# EAGLE design ir-sender (EAGLE 7.4.0)
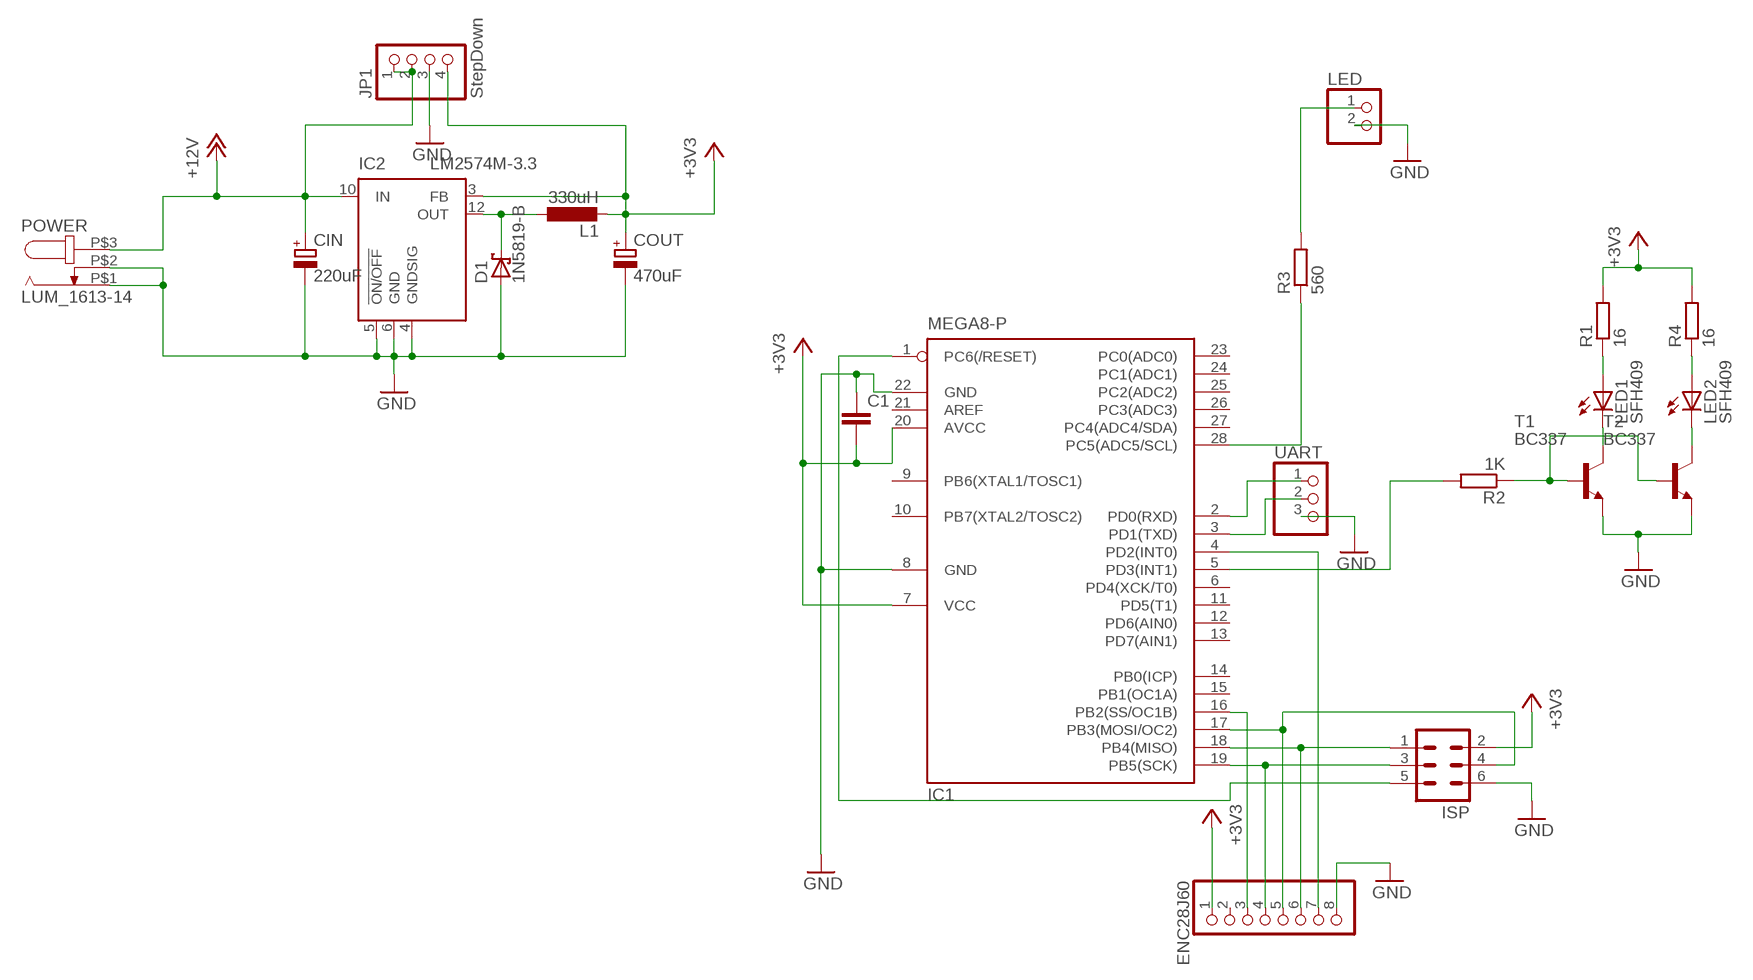
[diagram p0: schematic, sheet 1]

## Parts
C1  C-EU025-030X050  [C025-030X050]
CIN  220uF  CPOL-EUE3.5-8  [E3,5-8]
COUT  470uF  CPOL-EUE5-10.5  [E5-10,5]
D1  1N5819-B  [DO41-7.6]
ENC28J60  PINHD-1X8  [1X08]
IC1  MEGA8-P  [DIL28-3]
IC2  LM2574M-3.3  [SO14W]
ISP  ML6  [ML6]
JP1  StepDown  PINHD-1X4  [1X04]
L1  330uH  PIS4728  [PIS2816]
LED  PINHD-1X2  [1X02]
LED1  SFH409  LEDSFH482  [SFH482]
LED2  SFH409  LEDSFH482  [SFH482]
POWER  LUM_1613-14  [DCJ0202]
R1  16  R-EU_0207/7  [0207/7]
R2  1K  R-EU_0207/7  [0207/7]
R3  560  R-EU_0207/7  [0207/7]
R4  16  R-EU_0207/7  [0207/7]
T1  BC337  [TO92]
T2  BC337  [TO92]
UART  PINHD-1X3_2.54  [1X03]

## Nets
+3V3: C1.2 COUT.+ ENC28J60.1 IC1.7(VCC) IC1.20(AVCC) IC2.3(FB) ISP.2 JP1.4 L1.2 R1.2 R4.2
+12V: CIN.+ IC2.10(IN) JP1.1 JP1.2 POWER.P$3
GND: C1.1 CIN.- COUT.- D1.A ENC28J60.8 IC1.8(GND) IC1.22(GND) IC2.4(GNDSIG) IC2.5(!ON/OFF) IC2.6(GND) ISP.6 JP1.3 LED.2 POWER.P$1 POWER.P$2 T1.1(E) T2.1(E) UART.3
N$1: LED1.A R1.1
N$2: LED1.K(C) T1.3(C)
N$3: R2.1 T1.2(B) T2.2(B)
N$4: D1.C IC2.12(OUT) L1.1
N$5: LED.1 R3.2
N$6: ENC28J60.4 IC1.19(PB5(SCK)) ISP.3
N$7: ENC28J60.5 IC1.17(PB3(MOSI/OC2)) ISP.4
N$8: ENC28J60.6 IC1.18(PB4(MISO)) ISP.1
N$9: IC1.1(PC6(/RESET)) ISP.5
N$10: ENC28J60.3 IC1.16(PB2(SS/OC1B))
N$12: IC1.28(PC5(ADC5/SCL)) R3.1
N$13: IC1.5(PD3(INT1)) R2.2
N$14: ENC28J60.7 IC1.4(PD2(INT0))
N$16: LED2.A R4.1
N$17: LED2.K(C) T2.3(C)
N$19: IC1.2(PD0(RXD)) UART.1
N$20: IC1.3(PD1(TXD)) UART.2
Unconnected: ENC28J60.2 IC1.6(PD4(XCK/T0)) IC1.9(PB6(XTAL1/TOSC1)) IC1.10(PB7(XTAL2/TOSC2)) IC1.11(PD5(T1)) IC1.12(PD6(AIN0)) IC1.13(PD7(AIN1)) IC1.14(PB0(ICP)) IC1.15(PB1(OC1A)) IC1.21(AREF) IC1.23(PC0(ADC0)) IC1.24(PC1(ADC1)) IC1.25(PC2(ADC2)) IC1.26(PC3(ADC3)) IC1.27(PC4(ADC4/SDA))

## Library data of the parts
C1 = rcl:C-EU: CAPACITOR, European symbol
CIN COUT = rcl:CPOL-EU: POLARIZED CAPACITOR, European symbol
D1 = diode:1N581*: 1.0A SCHOTTKY BARRIER RECTIFIER Source: http://www.diodes.com/datasheets/ds23001.pdf
ENC28J60 = pinhead:PINHD-1X8: PIN HEADER
IC1 = atmel:MEGA8-P: MICROCONTROLLER 8 Kbytes FLASH, 1 kbytes SRAM, 512 bytes EEPROM, USART, 4-channel 10 bit ADC, 2-channel 8 bit ADC Pin compatible with Atmega48, ATMega88, ATMega168 Source: avr.lbr; OC_FARNELL: unknown; OC_NEWARK: unknown
IC2 = linear:LM2574?-*: SIMPLE SWITCHER 0.5A Step-Down Voltage Regulator Source: http://cache.national.com/ds/LM/LM2574.pdf
ISP = con-ml:ML6: HARTING; OC_FARNELL: unknown; OC_NEWARK: unknown
JP1 = pinhead:PINHD-1X4: PIN HEADER
L1 = jbolay:PIS4728
LED = pinhead:PINHD-1X2: PIN HEADER
LED1 LED2 = led:LED: LED OSRAM: - CHIPLED LG R971, LG N971, LY N971, LG Q971, LY Q971, LO R971, LY R971 LH N974, LH R974 LS Q976, LO Q976, LY Q976 LO Q996 - Hyper CHIPLED LW Q18S LB Q993, LB Q99A, LB R99A - SideLED LS A670, LO A670, LY A670, LG A670, LP A670 LB A673, LV A673, LT A673, LW A673 LH A674 LY A675 LS A676, LA A676, LO A676, LY A676, LW A676 LS A679, LY A679, LG A679 - Hyper Micro SIDELED® LS Y876, LA Y876, LO Y876, LY Y876 LT Y87S - SmartLED LW L88C, LW L88S LB L89C, LB L89S, LG L890 LS L89K, LO L89K, LY L89K LS L896, LA L896, LO L896, LY L896 - TOPLED LS T670, LO T670, LY T670, LG T670, LP T670 LSG T670, LSP T670, LSY T670, LOP T670, LYG T670 LG T671, LOG T671, LSG T671 LB T673, LV T673, LT T673, LW T673 LH T674 LS T676, LA T676, LO T676, LY T676, LB T676, LH T676, LSB T676, LW T676 LB T67C, LV T67C, LT T67C, LS T67K, LO T67K, LY T67K, LW E67C LS E67B, LA E67B, LO E67B, LY E67B, LB E67C, LV E67C, LT E67C LW T67C LS T679, LY T679, LG T679 LS T770, LO T770, LY T770, LG T770, LP T770 LB T773, LV T773, LT T773, LW T773 LH T774 LS E675, LA E675, LY E675, LS T675 LS T776, LA T776, LO T776, LY T776, LB T776 LHGB T686 LT T68C, LB T68C - Hyper Mini TOPLED® LB M676 - Mini TOPLED Santana® LG M470 LS M47K, LO M47K, LY M47K Source: http://www.osram.convergy.de LUXEON: - LUMILED® LXK2-PW12-R00, LXK2-PW12-S00, LXK2-PW14-U00, LXK2-PW14-V00 LXK2-PM12-R00, LXK2-PM12-S00, LXK2-PM14-U00 LXK2-PE12-Q00, LXK2-PE12-R00, LXK2-PE12-S00, LXK2-PE14-T00, LXK2-PE14-U00 LXK2-PB12-K00, LXK2-PB12-L00, LXK2-PB12-M00, LXK2-PB14-N00, LXK2-PB14-P00, LXK2-PB14-Q00 LXK2-PR12-L00, LXK2-PR12-M00, LXK2-PR14-Q00, LXK2-PR14-R00 LXK2-PD12-Q00, LXK2-PD12-R00, LXK2-PD12-S00 LXK2-PH12-R00, LXK2-PH12-S00 LXK2-PL12-P00, LXK2-PL12-Q00, LXK2-PL12-R00 Source: www.luxeon.com KINGBRIGHT: KA-3528ASYC Source: www.kingbright.com
POWER = jbolay:LUM_1613-14: Netzgeräte-Einbaukupplung, abgewinkelte Ausführung, mit Öffner, für Leiterplatten, Surface-Mount-Technik (SMT) Hohlstecker Reichelt Artikel-Nr.: LUM 1613-14
R1-R4 = rcl:R-EU_: RESISTOR, European symbol
T1 T2 = transistor:BC337: NPN TRANSISTOR
UART = pinhead-1:PINHD-1X3: PIN HEADER

## Net classes
0 default: width 0.4 mm, drill 0.8 mm, clearance 0.254 mm

## Board
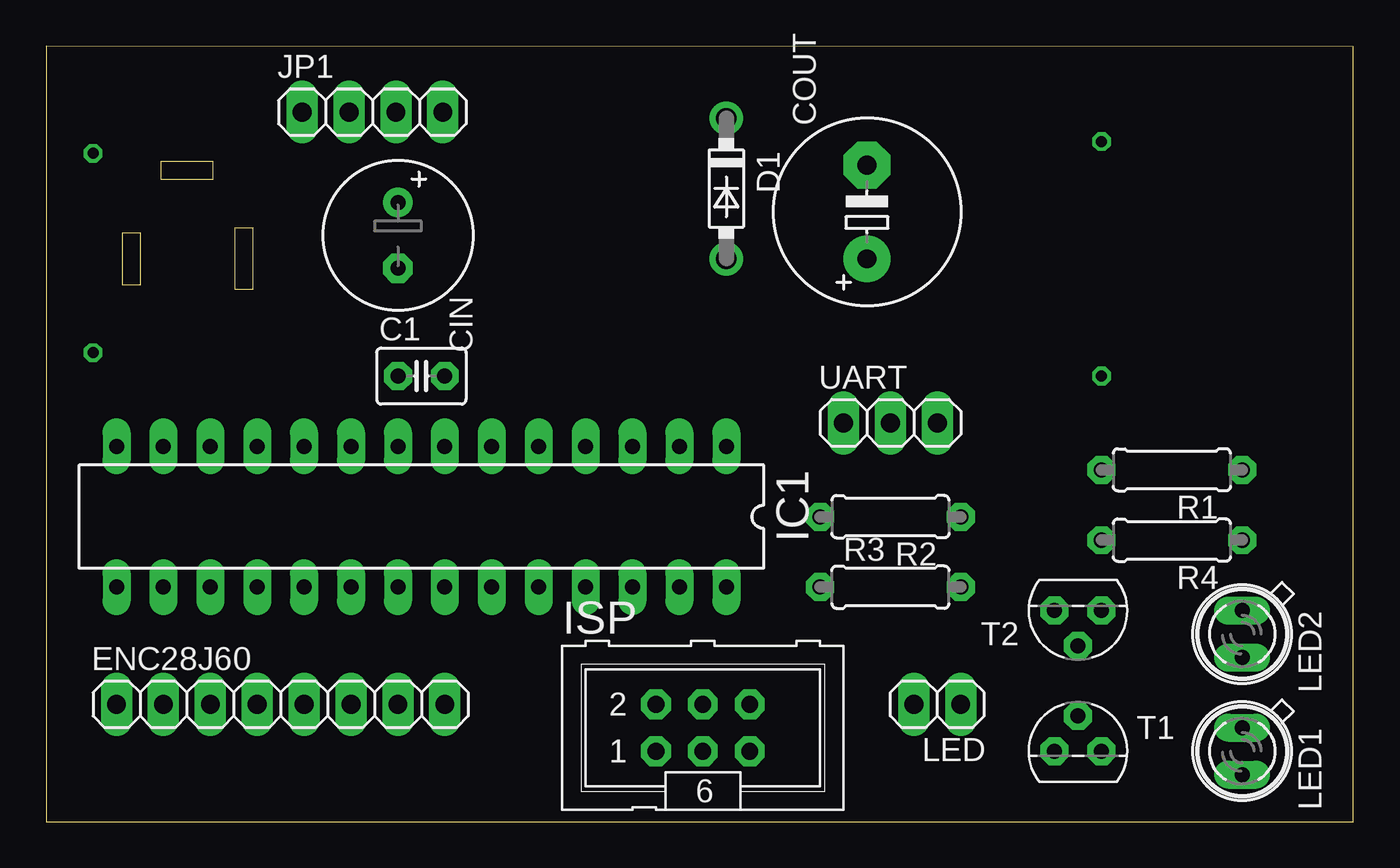
[diagram p1: board, top side]
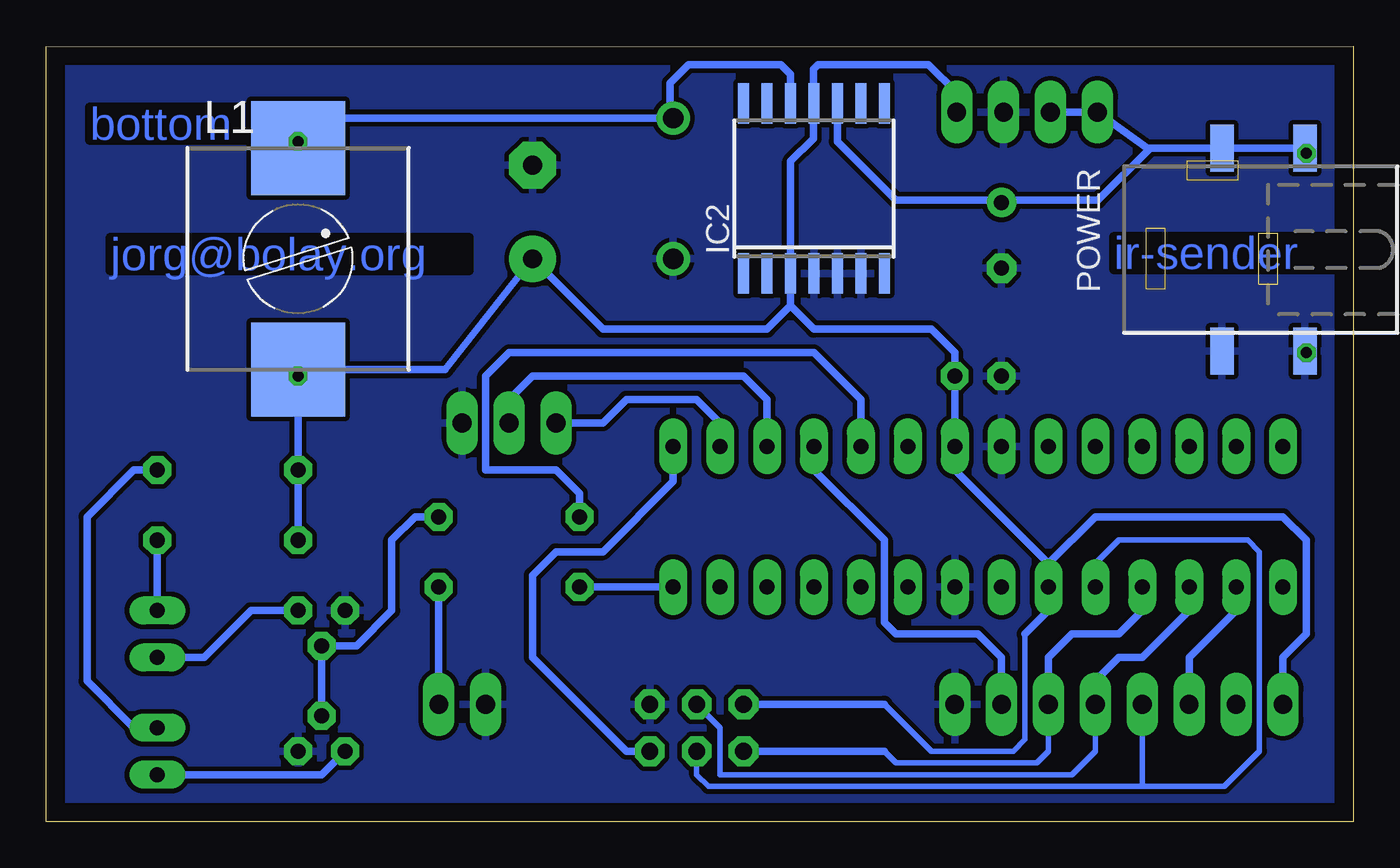
[diagram p2: board, bottom side, seen from below]

Size 70.79 x 42 mm. Coordinates in mm from the lower left corner, seen from the top.
Outline: 0,0 70.79,0 70.79,41.98 0,42 0,0
Copper layers (1*16): Top 0.035mm / dielectric 1.5mm / Bottom 0.035mm
Design rules "ir-sender *": minimum track width 10mil, minimum drill 0.8mm, track to track 0.205mm, track to pad 0.205mm, pad to pad 0.205mm, via to via 0.205mm, smd to smd 8mil, copper to edge 40mil, drill to drill 8mil, minimum pad ring 0.35mm, minimum via ring 8mil, stop-mask expansion 4mil, vias tented up to drill 0mil, thermal gap 10mil

### Footprints (pad centres in the part's own frame; a part is rotated, then mirrored left to right if it is on the bottom)
C025-030X050 = drill 0.813 octagon: 1 -1.27,0; 2 1.27,0
E3,5-8 = drill 0.813 pad 1.6: + -1.778,0 | drill 0.813 pad 1.6 octagon: - 1.778,0
E5-10,5 = drill 1.016 pad 2.54: + -2.54,0 | drill 1.016 pad 2.54 octagon: - 2.54,0
DO41-7.6 = drill 1.1 pad 1.7: A 3.81,0; C -3.81,0
1X08 = drill 1.016 long: 1 -8.89,0; 2 -6.35,0; 3 -3.81,0; 4 -1.27,0; 5 1.27,0; 6 3.81,0; 7 6.35,0; 8 8.89,0
DIL28-3 = drill 0.813 long: 1 -16.51,-3.81; 2 -13.97,-3.81; 3 -11.43,-3.81; 4 -8.89,-3.81; 5 -6.35,-3.81; 6 -3.81,-3.81; 7 -1.27,-3.81; 8 1.27,-3.81; 9 3.81,-3.81; 10 6.35,-3.81; 11 8.89,-3.81; 12 11.43,-3.81; 13 13.97,-3.81; 14 16.51,-3.81; 15 16.51,3.81; 16 13.97,3.81; 17 11.43,3.81; 18 8.89,3.81; 19 6.35,3.81; 20 3.81,3.81; 21 1.27,3.81; 22 -1.27,3.81; 23 -3.81,3.81; 24 -6.35,3.81; 25 -8.89,3.81; 26 -11.43,3.81; 27 -13.97,3.81; 28 -16.51,3.81
SO14W = smd 0.6 x 2.2: 1 -3.81,-4.6; 2 -2.54,-4.6; 3 -1.27,-4.6; 4 0,-4.6; 5 1.27,-4.6; 6 2.54,-4.6; 7 3.81,-4.6; 8 3.81,4.6; 9 2.54,4.6; 10 1.27,4.6; 11 0,4.6; 12 -1.27,4.6; 13 -2.54,4.6; 14 -3.81,4.6
ML6 = drill 0.914 octagon: 1 -2.54,-1.27; 2 -2.54,1.27; 3 0,-1.27; 4 0,1.27; 5 2.54,-1.27; 6 2.54,1.27
1X04 = drill 1.016 long: 1 -3.81,0; 2 -1.27,0; 3 1.27,0; 4 3.81,0
PIS2816 = smd 5.08 x 5.08: 1 0,6; 2 0,-6
1X02 = drill 1.016 long: 1 -1.27,0; 2 1.27,0
SFH482 = drill 0.813 long: A -1.27,0; K 1.27,0
DCJ0202 = smd 2.54 x 1.27: P$1 -5,-5; P$2 -5,-0.5; P$3 6,-5; P$4 6,-0.5
0207/7 = drill 0.813 octagon: 1 -3.81,0; 2 3.81,0
TO92 = drill 0.813 octagon: 1 1.27,0; 2 0,1.905; 3 -1.27,0
1X03 = drill 1.016 long: 1 -2.54,0; 2 0,0; 3 2.54,0

### Placement (x,y rotation side)
C1  20.32,24.13 0 top
CIN  19.05,31.75 270 top
COUT  44.45,33.02 90 top
D1  36.83,34.29 270 top
DRILEGEND  [DRILEGEND]  -8.03,-9.64 0 top  (outside the outline)
ENC28J60  12.7,6.35 0 top
IC1  20.32,16.51 180 top
IC2  29.21,34.29 0 bottom
ISP  35.56,5.08 0 top
JP1  17.67,38.43 0 top
L1  57.15,30.48 0 bottom
LED  48.26,6.35 180 top
LED1  64.77,3.81 270 top
LED2  64.77,10.16 270 top
POWER  7.62,30.48 90 bottom
R1  60.96,19.05 180 top
R2  45.72,16.51 180 top
R3  45.72,12.7 0 top
R4  60.96,15.24 180 top
T1  55.88,3.81 0 top
T2  55.88,11.43 180 top
UART  45.72,21.59 0 top

### Tracks (layer width: path | path; a pad name or v marks a point on that pad's centre or on a via)
+3V3  (via drill 0.6)
  Bottom 0.305: 17.78,10.16 17.78,4.45 18.41,3.81 22.86,3.81 25.4,6.35
  Bottom 0.406: R4.2 R1.2 v57.15,24.13 L1.2 49.18,24.48 COUT.+ 40.64,26.67 31.75,26.67 30.48,27.94 | ISP.2 25.4,6.35 | 17.78,10.16 16.51,11.43 IC1.20 16.51,13.97 | 16.51,13.97 21.59,19.05 IC1.7 C1.2 21.59,25.4 22.86,26.67 29.21,26.67 30.48,27.94 | ENC28J60.1 3.81,8.89 2.54,10.16 2.54,15.24 3.81,16.51 13.97,16.51 16.51,13.97 | 30.48,27.94 IC2.3 30.48,35.77 29.25,37 29.25,40.75 29,41 23,41 21.48,39.48 JP1.4
+12V
  Bottom 0.406: IC2.10 27.94,36.83 24.77,33.66 19.18,33.66 | 19.18,33.66 CIN.+ | POWER.P$3 11,36.48 | 11,36.48 11.16,36.48 JP1.1 JP1.2 | 19.18,33.66 13.82,33.66 11,36.48
GND
  pour Bottom: -1,43 72,43 72,-1 -1,-1
N$1
  Bottom 0.406: LED1.A 66.04,5.08 68.58,7.62 68.58,16.51 66.04,19.05 R1.1
N$2
  Bottom 0.406: LED1.K 55.88,2.54 T1.3
N$3
  Bottom 0.406: T1.2 T2.2 53.98,9.53 52.07,11.43 52.07,15.24 50.8,16.51 R2.1
N$4
  Bottom 0.406: L1.1 57.15,38.1 D1.C 37,38.27 37,40 36,41 31,41 30.48,40.48 IC2.12
N$5
  Bottom 0.406: LED.1 R3.2
N$6
  Bottom 0.305: 11.43,1.91 34.92,1.91 35.56,2.54 ISP.3 | 11.43,1.91 ENC28J60.4 | 11.43,1.91 6.99,1.91 5.08,3.81 5.08,14.61 5.71,15.24 12.7,15.24 13.97,13.97 IC1.19
N$7
  Bottom 0.305: ENC28J60.5 13.97,3.81 15.24,2.54 34.29,2.54 34.29,5.08 ISP.4
  Bottom 0.406: IC1.17 8.89,11.43 11.43,8.89 12.7,8.89 13.97,7.62 ENC28J60.5
N$8
  Bottom 0.305: 25.4,3.81 24.77,3.17 17.14,3.17 16.51,3.81 ENC28J60.6
  Bottom 0.406: ISP.1 25.4,3.81 | IC1.18 11.43,11.43 12.7,10.16 15.24,10.16 16.51,8.89 ENC28J60.6
N$9
  Bottom 0.406: ISP.5 39.37,3.81 44.45,8.89 44.45,13.34 43.18,14.61 40.64,14.61 36.83,18.41 IC1.1
N$10
  Bottom 0.406: IC1.16 6.35,11.43 8.89,8.89 ENC28J60.3
N$11  (via drill 0.6)
  other vias: 57.15,36.83
N$12
  Bottom 0.406: IC1.28 R3.1
N$13
  Bottom 0.406: R2.2 41.91,17.78 43.18,19.05 46.99,19.05 46.99,24.13 45.72,25.4 29.21,25.4 26.67,22.86 IC1.5
N$14
  Bottom 0.406: IC1.4 29.21,19.05 25.4,15.24 25.4,10.79 24.77,10.16 20.32,10.16 19.05,8.89 ENC28J60.7
N$15  (via drill 0.6)
  other vias: 2.54,36.2
N$16
  Bottom 0.406: R4.1 LED2.A
N$17
  Bottom 0.406: LED2.K 62.23,8.89 59.69,11.43 T2.3
N$18  (via drill 0.6)
  other vias: 2.54,25.4
N$19
  Bottom 0.406: IC1.2 34.29,21.59 35.56,22.86 39.37,22.86 40.64,21.59 UART.1
N$20
  Bottom 0.406: IC1.3 31.75,22.86 33.02,24.13 44.45,24.13 45.72,22.86 UART.2

### Text on the board
Bottom: bottom | ir-sender | jorg@bolay.org
DrillLegend: LAYER-STACK
DrillLegend_01-16: 01-16